# EAGLE schematic main (EAGLE 6.5.0)
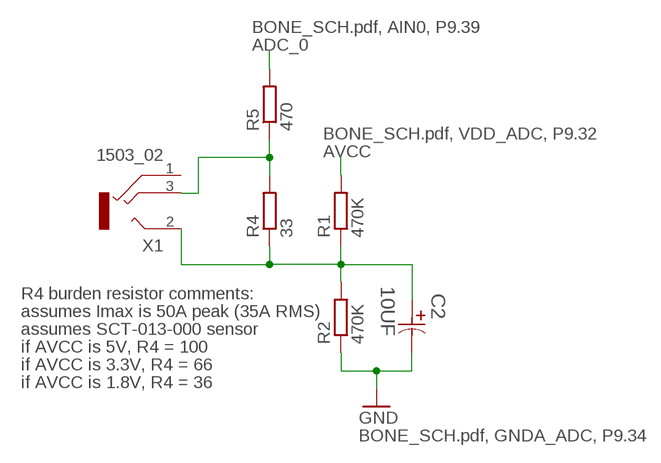
[diagram p0: schematic, sheet 1]

## Parts
C2  10UF  EEE-1EA100SR-CASE-C  [CAPAE530X610N]
R1  470K  R-EU_M1206  [M1206]
R2  470K  R-EU_M1206  [M1206]
R4  33  R-EU_M1206  [M1206]
R5  470  R-EU_M1206  [M1206]
X1  1503_02  [1503_02]

## Nets
ADC_0: R5.2
AVCC: R1.2
GND: C2.2 R2.1
N$1: C2.1 R1.1 R2.2 R4.1 X1.2
N$2: R4.2 R5.1 X1.3
Unconnected: X1.1 X1.2@2

## Notes on the sheet
- BONE_SCH.pdf, AIN0, P9.39
- BONE_SCH.pdf, VDD_ADC, P9.32
- R4 burden resistor comments:
- assumes Imax is 50A peak (35A RMS)
- assumes SCT-013-000 sensor
- if AVCC is 5V, R4 = 100
- if AVCC is 3.3V, R4 = 66
- if AVCC is 1.8V, R4 = 36
- BONE_SCH.pdf, GNDA_ADC, P9.34

## Library data of the parts
C2 = Panasonic-EEE0_EEE1_EEE2_EEEFC:EEE-: Aluminum Electrolytic Capacitors,Surface Mount Type; MPN: EEE-1EA100SR; OC_FARNELL: 9696962; OC_NEWARK: 96K9429; PACKAGE: CASE-C; SUPPLIER: PANASONIC; TOLERANCE: 20%; VOLTAGERATING: 25V
R1 R2 R4 R5 = rcl:R-EU_: RESISTOR, European symbol
X1 = con-lumberg:1503_02: Jack connectors according to JISC 6560, 3.5 mm Klinkeneinbaukupplung nach JISC 6560, 3,5 mm, 3-polig/stereo, abgewinkelte Ausführung, Surface-Mount-Technik (SMT) Source: http://www.lumberg.com/Produkte/PDFs/1503_02.pdf; OC_FARNELL: 1216979; OC_NEWARK: unknown